# Altium project flipdot.PrjPCB
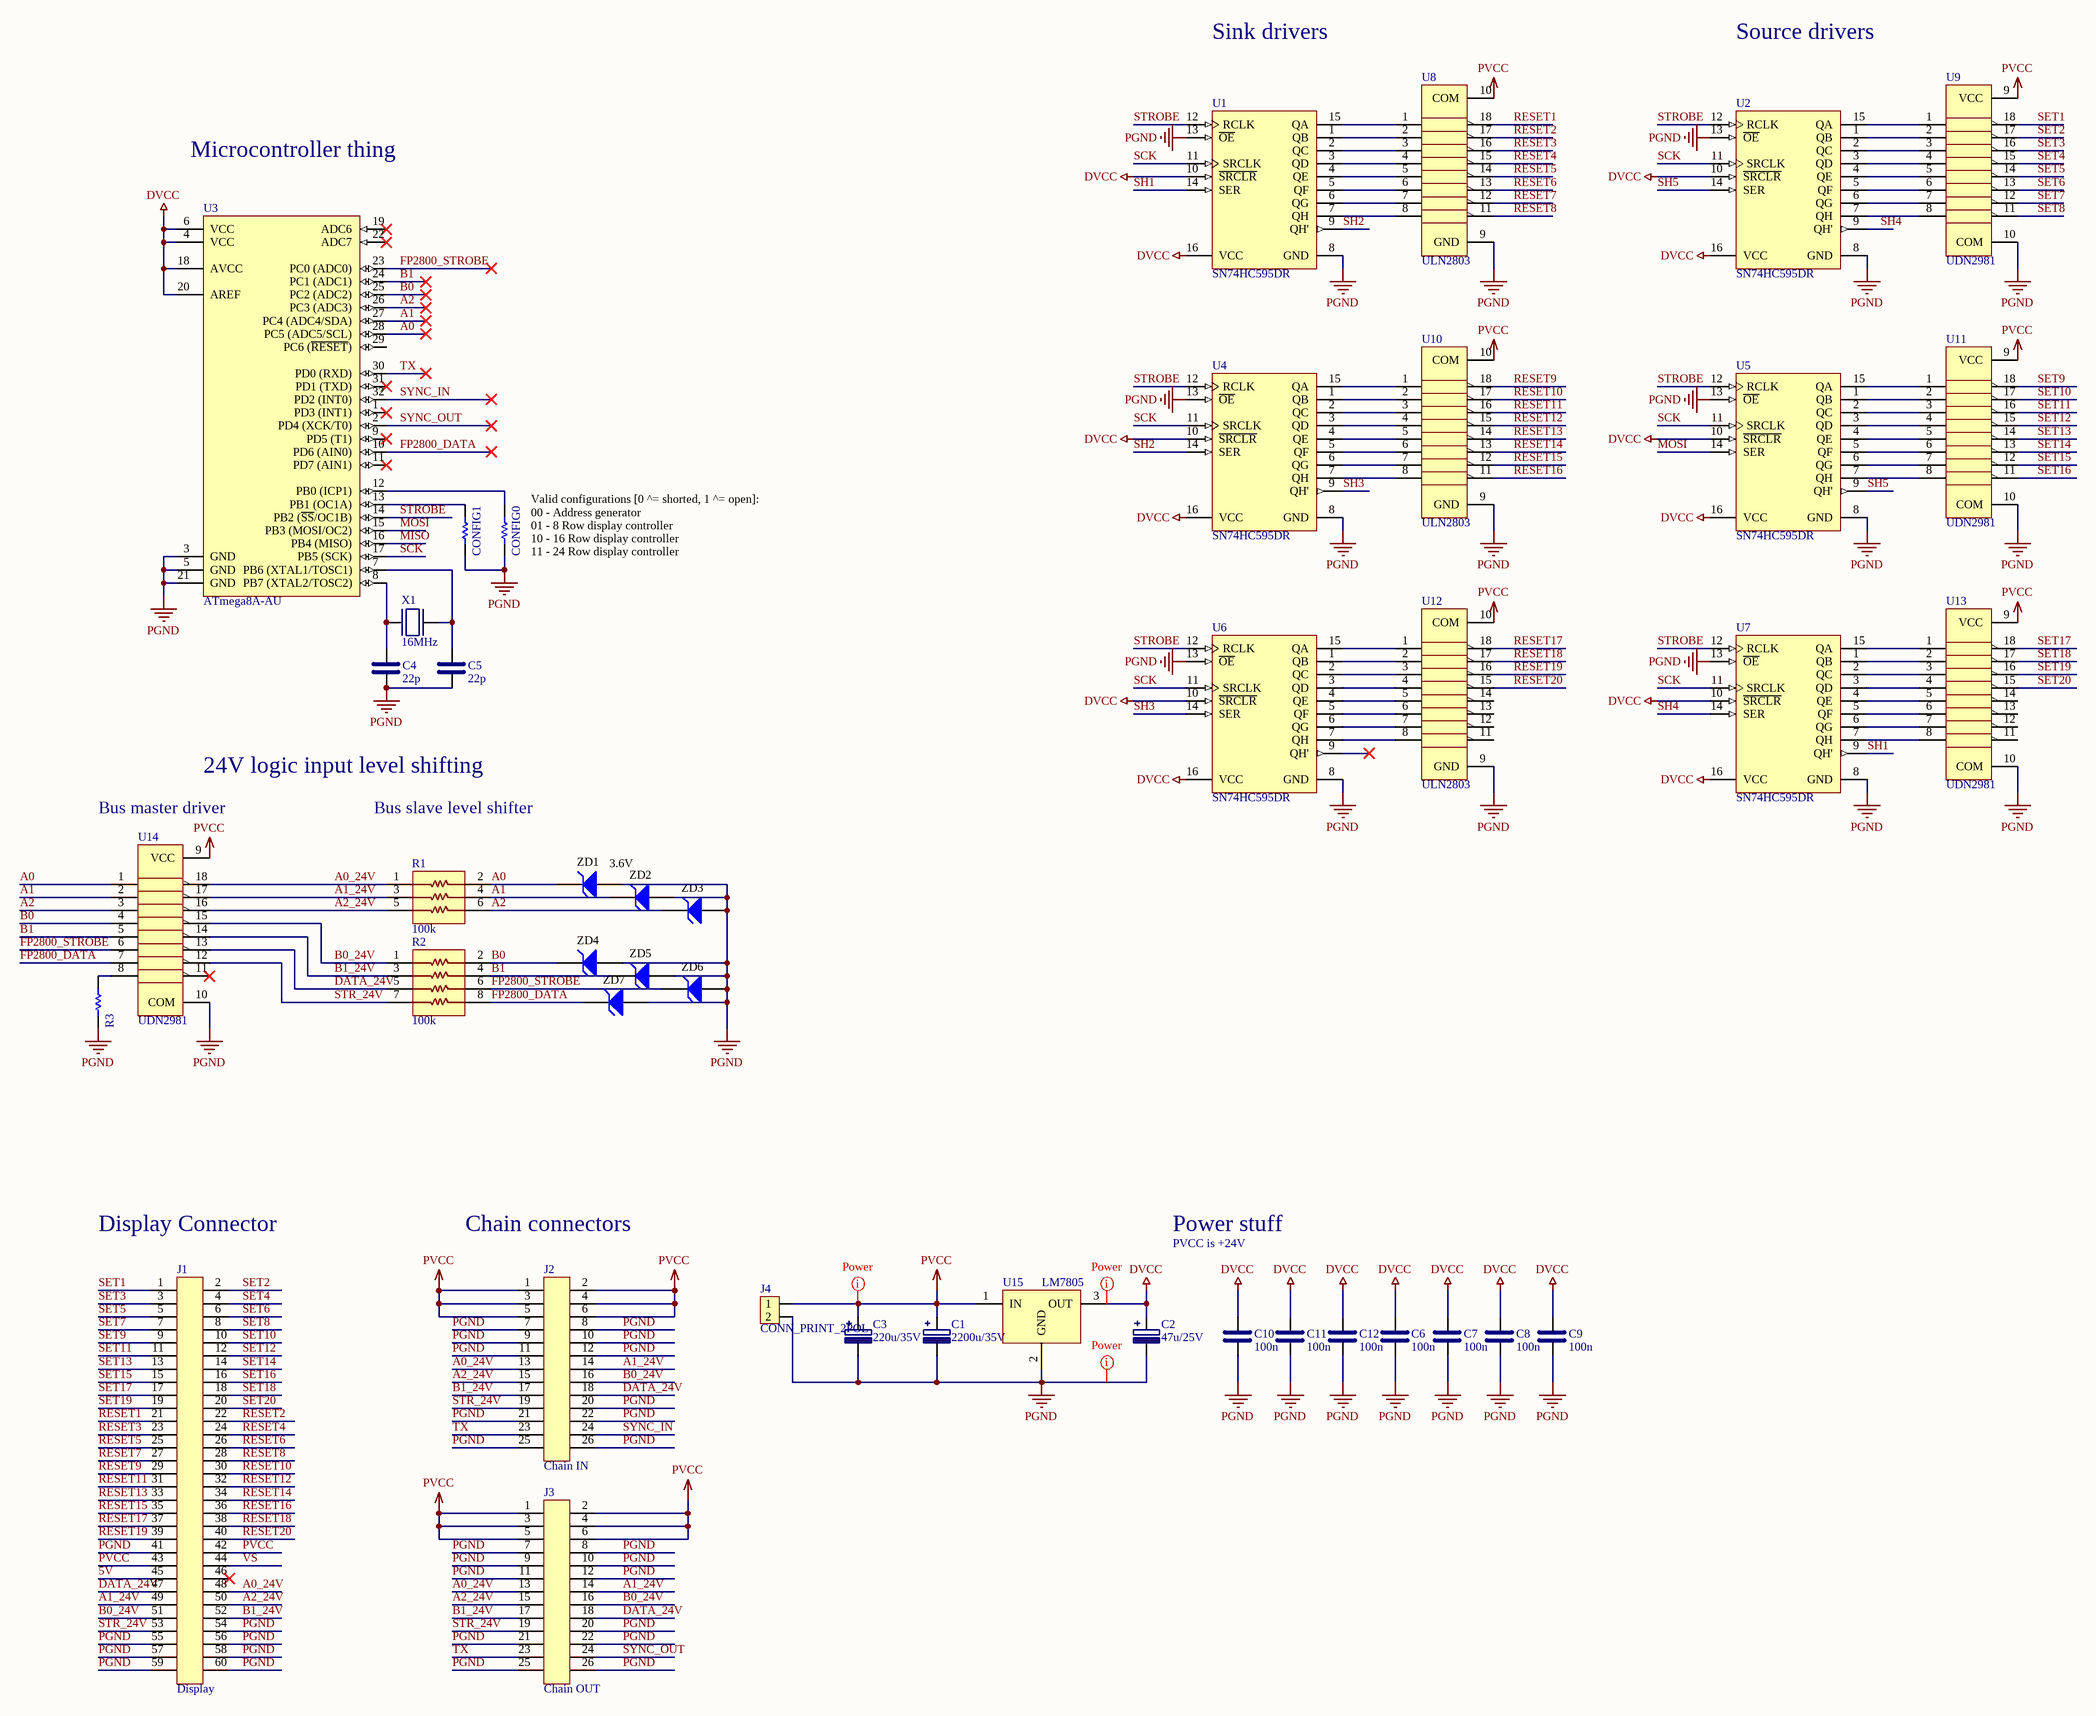
[diagram p0: flipdot.SchDoc]
revision: 1.0
1 sheet, 44 parts. Net scope: global (net labels, ports and power ports of the same name join across sheets).
Board file: flipdot.PcbDoc

## Sheet flipdot.SchDoc
size A2

### Parts
C1  2200u/35V  [ELKO_RAD_SIDE_RM7.5_16x25]
C2  47u/25V  [ELKO_RAD_RM2.0_dia5.0]
C3  220u/35V  [ELKO_RAD_RM3.5_dia8.0]
C4  22p  [6-0805_M]
C5  22p  [6-0805_M]
C6  100n  [6-0805_M]
C7  100n  [6-0805_M]
C8  100n  [6-0805_M]
C9  100n  [6-0805_M]
C10  100n  [6-0805_M]
C11  100n  [6-0805_M]
C12  100n  [6-0805_M]
CONFIG0  Jumper 0603(1608)  [RESC0603(1608)_N]  (value not drawn)
CONFIG1  Jumper 0603(1608)  [RESC0603(1608)_N]  (value not drawn)
J1  Display  [PINHD_2x30_100mil]
J2  Chain IN  [PINHD_2x13_100mil]
J3  Chain OUT  [PINHD_2x13_100mil]
J4  CONN_PRINT_2POL  [CONN_PLUG_2P_5.08]
R1  100k  [RNET_SIL_100mil_6P]
R2  100k  [RNET_SIL_100mil_8P]
R3  Jumper 0603(1608)  [RESC0603(1608)_N]  (value not drawn)
U1  SN74HC595DR  [D0016A_M]
U2  SN74HC595DR  [D0016A_M]
U3  ATmega8A-AU  [32A_M]
U4  SN74HC595DR  [D0016A_M]
U5  SN74HC595DR  [D0016A_M]
U6  SN74HC595DR  [D0016A_M]
U7  SN74HC595DR  [D0016A_M]
U8  ULN2803  [PDIP-18]
U9  UDN2981  [PDIP-18]
U10  ULN2803  [PDIP-18]
U11  UDN2981  [PDIP-18]
U12  ULN2803  [PDIP-18]
U13  UDN2981  [PDIP-18]
U14  UDN2981  [PDIP-18]
U15  LM7805  [TO92]
X1  16MHz  [XTAL-HC49]
ZD1  3.6V  [FAIR-DO-41-2_V]
ZD2  3.6V  [FAIR-DO-41-2_V]  (value not drawn)
ZD3  3.6V  [FAIR-DO-41-2_V]  (value not drawn)
ZD4  3.6V  [FAIR-DO-41-2_V]  (value not drawn)
ZD5  3.6V  [FAIR-DO-41-2_V]  (value not drawn)
ZD6  3.6V  [FAIR-DO-41-2_V]  (value not drawn)
ZD7  3.6V  [FAIR-DO-41-2_V]  (value not drawn)

### Nets
DVCC: C2.P(+) C6.1(+) C7.1(+) C8.1(+) C9.1(+) C10.1(+) C11.1(+) C12.1(+) U1.10(~{SRCLR}) U1.16(VCC) U2.10(~{SRCLR}) U2.16(VCC) U3.4(VCC) U3.6(VCC) U3.18(AVCC) U3.20(AREF) U4.10(~{SRCLR}) U4.16(VCC) U5.10(~{SRCLR}) U5.16(VCC) U6.10(~{SRCLR}) U6.16(VCC) U7.10(~{SRCLR}) U7.16(VCC) U15.3(OUT)
PGND: C1.N(-) C2.N(-) C3.N(-) C4.2(-) C5.2(-) C6.2(-) C7.2(-) C8.2(-) C9.2(-) C10.2(-) C11.2(-) C12.2(-) CONFIG0.2 CONFIG1.1 J1.41 J1.54 J1.55 J1.56 J1.57 J1.58 J1.59 J1.60 J2.7 J2.8 J2.9 J2.10 J2.11 J2.12 J2.20 J2.21 J2.22 J2.25 J2.26 J3.7 J3.8 J3.9 J3.10 J3.11 J3.12 J3.20 J3.21 J3.22 J3.25 J3.26 J4.2 R3.2 U1.8(GND) U1.13(~{OE}) U2.8(GND) U2.13(~{OE}) U3.3(GND) U3.5(GND) U3.21(GND) U4.8(GND) U4.13(~{OE}) U5.8(GND) U5.13(~{OE}) U6.8(GND) U6.13(~{OE}) U7.8(GND) U7.13(~{OE}) U8.9(GND) U9.10(COM) U10.9(GND) U11.10(COM) U12.9(GND) U13.10(COM) U14.10(COM) U15.2(GND) ZD1.1(A) ZD2.1(A) ZD3.1(A) ZD4.1(A) ZD5.1(A) ZD6.1(A) ZD7.1(A)
PVCC: C1.P(+) C3.P(+) J1.42 J1.43 J2.1 J2.2 J2.3 J2.4 J2.5 J2.6 J3.1 J3.2 J3.3 J3.4 J3.5 J3.6 J4.1 U8.10(COM) U9.9(VCC) U10.10(COM) U11.9(VCC) U12.10(COM) U13.9(VCC) U14.9(VCC) U15.1(IN)
5V: J1.45
A0: R1.2 U3.28(PC5_(ADC5/SCL)) U14.1(IN1) ZD1.2(K)
A0_24V: J1.48 J2.13 J3.13 R1.1(COM) U14.18(OUT1)
A1: R1.4 U3.27(PC4_(ADC4/SDA)) U14.2(IN2) ZD2.2(K)
A1_24V: J1.49 J2.14 J3.14 R1.3 U14.17(OUT2)
A2: R1.6 U3.26(PC3_(ADC3)) U14.3(IN3) ZD3.2(K)
A2_24V: J1.50 J2.15 J3.15 R1.5 U14.16(OUT3)
B0: R2.2 U3.25(PC2_(ADC2)) U14.4(IN4) ZD4.2(K)
B0_24V: J1.51 J2.16 J3.16 R2.1(COM) U14.15(OUT4)
B1: R2.4 U3.24(PC1_(ADC1)) U14.5(IN5) ZD5.2(K)
B1_24V: J1.52 J2.17 J3.17 R2.3 U14.14(OUT5)
DATA_24V: J1.47 J2.18 J3.18 R2.5 U14.13(OUT6)
FP2800_DATA: R2.8 U3.10(PD6_(AIN0)) U14.7(IN7) ZD7.2(K)
FP2800_STROBE: R2.6 U3.23(PC0_(ADC0)) U14.6(IN6) ZD6.2(K)
MISO: U3.16(PB4_(MISO))
MOSI: U3.15(PB3_(MOSI/OC2)) U5.14(SER)
RESET1: J1.21 U8.18(OUT1)
RESET2: J1.22 U8.17(OUT2)
RESET3: J1.23 U8.16(OUT3)
RESET4: J1.24 U8.15(OUT4)
RESET5: J1.25 U8.14(OUT5)
RESET6: J1.26 U8.13(OUT6)
RESET7: J1.27 U8.12(OUT7)
RESET8: J1.28 U8.11(OUT8)
RESET9: J1.29 U10.18(OUT1)
RESET10: J1.30 U10.17(OUT2)
RESET11: J1.31 U10.16(OUT3)
RESET12: J1.32 U10.15(OUT4)
RESET13: J1.33 U10.14(OUT5)
RESET14: J1.34 U10.13(OUT6)
RESET15: J1.35 U10.12(OUT7)
RESET16: J1.36 U10.11(OUT8)
RESET17: J1.37 U12.18(OUT1)
RESET18: J1.38 U12.17(OUT2)
RESET19: J1.39 U12.16(OUT3)
RESET20: J1.40 U12.15(OUT4)
SCK: U1.11(SRCLK) U2.11(SRCLK) U3.17(PB5_(SCK)) U4.11(SRCLK) U5.11(SRCLK) U6.11(SRCLK) U7.11(SRCLK)
SET1: J1.1 U9.18(OUT1)
SET2: J1.2 U9.17(OUT2)
SET3: J1.3 U9.16(OUT3)
SET4: J1.4 U9.15(OUT4)
SET5: J1.5 U9.14(OUT5)
SET6: J1.6 U9.13(OUT6)
SET7: J1.7 U9.12(OUT7)
SET8: J1.8 U9.11(OUT8)
SET9: J1.9 U11.18(OUT1)
SET10: J1.10 U11.17(OUT2)
SET11: J1.11 U11.16(OUT3)
SET12: J1.12 U11.15(OUT4)
SET13: J1.13 U11.14(OUT5)
SET14: J1.14 U11.13(OUT6)
SET15: J1.15 U11.12(OUT7)
SET16: J1.16 U11.11(OUT8)
SET17: J1.17 U13.18(OUT1)
SET18: J1.18 U13.17(OUT2)
SET19: J1.19 U13.16(OUT3)
SET20: J1.20 U13.15(OUT4)
SH1: U1.14(SER) U7.9(QH')
SH2: U1.9(QH') U4.14(SER)
SH3: U4.9(QH') U6.14(SER)
SH4: U2.9(QH') U7.14(SER)
SH5: U2.14(SER) U5.9(QH')
STR_24V: J1.53 J2.19 J3.19 R2.7 U14.12(OUT7)
STROBE: U1.12(RCLK) U2.12(RCLK) U3.14(PB2_(~{SS}/OC1B)) U4.12(RCLK) U5.12(RCLK) U6.12(RCLK) U7.12(RCLK)
SYNC_IN: J2.24 U3.32(PD2_(INT0))
SYNC_OUT: J3.24 U3.2(PD4_(XCK/T0))
TX: J2.23 J3.23 U3.30(PD0_(RXD))
VS: J1.44
NetC4_1: C4.1(+) U3.8(PB7_(XTAL2/TOSC2)) X1.1
NetC5_1: C5.1(+) U3.7(PB6_(XTAL1/TOSC1)) X1.2
NetCONFIG0_1: CONFIG0.1 U3.12(PB0_(ICP1))
NetCONFIG1_2: CONFIG1.2 U3.13(PB1_(OC1A))
NetR3_1: R3.1 U14.8(IN8)
NetU1_1: U1.1(QB) U8.2(IN2)
NetU1_2: U1.2(QC) U8.3(IN3)
NetU1_3: U1.3(QD) U8.4(IN4)
NetU1_4: U1.4(QE) U8.5(IN5)
NetU1_5: U1.5(QF) U8.6(IN6)
NetU1_6: U1.6(QG) U8.7(IN7)
NetU1_7: U1.7(QH) U8.8(IN8)
NetU1_15: U1.15(QA) U8.1(IN1)
NetU2_1: U2.1(QB) U9.2(IN2)
NetU2_2: U2.2(QC) U9.3(IN3)
NetU2_3: U2.3(QD) U9.4(IN4)
NetU2_4: U2.4(QE) U9.5(IN5)
NetU2_5: U2.5(QF) U9.6(IN6)
NetU2_6: U2.6(QG) U9.7(IN7)
NetU2_7: U2.7(QH) U9.8(IN8)
NetU2_15: U2.15(QA) U9.1(IN1)
NetU4_1: U4.1(QB) U10.2(IN2)
NetU4_2: U4.2(QC) U10.3(IN3)
NetU4_3: U4.3(QD) U10.4(IN4)
NetU4_4: U4.4(QE) U10.5(IN5)
NetU4_5: U4.5(QF) U10.6(IN6)
NetU4_6: U4.6(QG) U10.7(IN7)
NetU4_7: U4.7(QH) U10.8(IN8)
NetU4_15: U4.15(QA) U10.1(IN1)
NetU5_1: U5.1(QB) U11.2(IN2)
NetU5_2: U5.2(QC) U11.3(IN3)
NetU5_3: U5.3(QD) U11.4(IN4)
NetU5_4: U5.4(QE) U11.5(IN5)
NetU5_5: U5.5(QF) U11.6(IN6)
NetU5_6: U5.6(QG) U11.7(IN7)
NetU5_7: U5.7(QH) U11.8(IN8)
NetU5_15: U5.15(QA) U11.1(IN1)
NetU6_1: U6.1(QB) U12.2(IN2)
NetU6_2: U6.2(QC) U12.3(IN3)
NetU6_3: U6.3(QD) U12.4(IN4)
NetU6_4: U6.4(QE) U12.5(IN5)
NetU6_5: U6.5(QF) U12.6(IN6)
NetU6_6: U6.6(QG) U12.7(IN7)
NetU6_7: U6.7(QH) U12.8(IN8)
NetU6_15: U6.15(QA) U12.1(IN1)
NetU7_1: U7.1(QB) U13.2(IN2)
NetU7_2: U7.2(QC) U13.3(IN3)
NetU7_3: U7.3(QD) U13.4(IN4)
NetU7_4: U7.4(QE) U13.5(IN5)
NetU7_5: U7.5(QF) U13.6(IN6)
NetU7_6: U7.6(QG) U13.7(IN7)
NetU7_7: U7.7(QH) U13.8(IN8)
NetU7_15: U7.15(QA) U13.1(IN1)

Not connected (* = marked no-connect by the designer): J1 46*; U3 1(PD3_(INT1))* 9(PD5_(T1))* 11(PD7_(AIN1))* 19(ADC6)* 22(ADC7)* 29(PC6_(~{RESET})) 31(PD1_(TXD))*; U6 9(QH')*; U12 11(OUT8) 12(OUT7) 13(OUT6) 14(OUT5); U13 11(OUT8) 12(OUT7) 13(OUT6) 14(OUT5); U14 11(OUT8)*

### Layout directives
net class Power: DVCC, PGND, PVCC

### Notes on the sheet
- Sink drivers
- Source drivers
- Microcontroller thing
- (near CONFIG0) Valid configurations [0 ^= shorted, 1 ^= open]:
  00 - Address generator
  01 - 8 Row display controller
  10 - 16 Row display controller
  11 - 24 Row display controller
- (near U14) Bus master driver
- 24V logic input level shifting
- Bus slave level shifter
- Display Connector
- Chain connectors
- Power stuff
- PVCC is +24V

### Library data of the parts
C1-C3 = CP: Electrolytic Capacitor
C4-C12 = CCer: Ceramic Capacitor
CONFIG0 CONFIG1 R3 = CMP-1012-00001-1: Jumper 0603 (1608 Metric); Case-Metric: 1608; Value: 0.00 Ohm; Power: None; Case-EIA: 0603; Technology: SMT; Tolerance: None
J1 = PINHD_2x30
J2 J3 = PINHD_2x13
R1 = Rnet_Parallel_6: 6-pin Parallel Resistor Network
R2 = Rnet_Parallel_8: 8-pin Parallel Resistor Network
U1 U2 U4-U7 = CMP-0780-00037-3: 8-Bit Shift Registers With 3-State Output Registers, D0016A, LARGE T&R; Manufacturer: Texas Instruments; Output Drive (IOL/IOH)(Max)(mA): 7.8/-7.8; Rating: Military; ICC @ Nom Voltage(Max)(mA): 0.08; VCC(Min)(V): 2; tpd @ Nom Voltage(Max)(ns): 34; 3-State Output: Yes; Output Type: CMOS; Voltage(Nom)(V): 6; F @ Nom Voltage(Max)(Mhz): 28; Technology Family: HC; Bits: 4; PackageReference: D0016A; Code_JEDEC: MS-012 variation AC; Generic Part Number: SN74HC595; Operating Temperature Range(C): -40 to 85; DatasheetVersion: SCLS041H; PackageVersion: http://www.ti.com/lit/ml/mpds178g/mpds178g.pdf; Input Type: CMOS; VCC(Max)(V): 6
U3 = CMP-0095-00219-1: 8-bit AVR Microcontroller, 8KB Flash, 512 Bytes EEPROM, 1KB SRAM, 32-pin TQFP, Industrial Grade (-40°C to 85°C); PackageVersion: revB, Oct-2001; Code_JEDEC: MS-026-ABA; PackageReference: 32A; PackageDescription: 32-Lead, 7x7x1.0 mm Body, 0.8mm Lead Pitch, Thin Profile Plastic Quad Flat Package (TQFP); DatasheetVersion: revC, Jul-2009
U8 U10 U12 = ULN2803: ULN2803 Octal Darlington Sink Driver
U9 U11 U13 U14 = UDN2981: UDN2981 Octal Darlington Source Driver/Level Shifter
U15 = LM7805: 5V Linear Regulator
X1 = XTAL
ZD1-ZD7 = CMP-0892-00009-1: Zener Diode, 5.6V, 1W, 5%, -65 to 200 degC, 2-Pin DO-41, Body 2.72 x 5.2 mm, RoHS; Manufacturer: Fairchild Semiconductor; PartNumber: 1N4734A; VZ (Min.) (V): 5.32; IR (uA): 10; ZZ (Max) (ohm): 5; VZ (Max.) (V): 5.88; PD (W): 1; Test Current IZ (mA): 45; Mounting Technology: Through Hole; DatasheetVersion: Rev. H3; ComponentLink1Description: Manufacturer URL; ComponentLink2URL: http://www.fairchildsemi.com/ds/1N/1N4744A.pdf; ComponentLink3Description: Package Specification; Tolerance: 5%; RoHS: TRUE; ComponentLink2Description: Datasheet; PackageDescription: 2-Pin Axial leaded, Body 2.72 x 5.2 mm, Lead Spread 25.4 mm; Operating and Storage Temperature Range: -65 to 200 degC; PackageReference: DO-41-2; PackageVersion: Rev. 2; ComponentLink1URL: http://www.fairchildsemi.com/; ComponentLink3URL: http://www.fairchildsemi.com/dwg/DO/DO41A.pdf